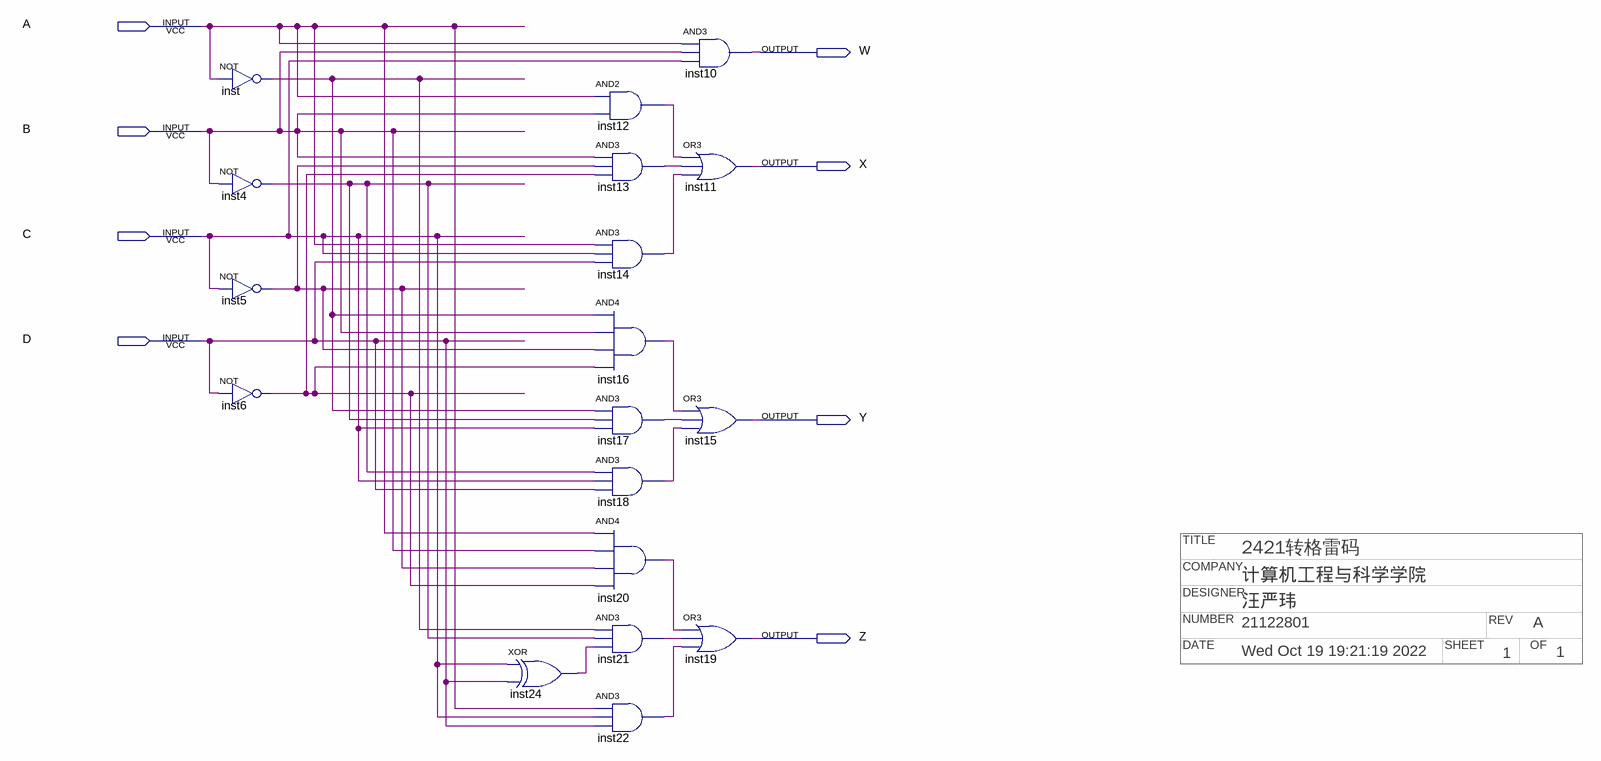
[diagram p0: schematic sheet]
// Quartus schematic 2421_to_gray.bdf as structural Verilog: 18 symbols, 8 pins
// Title block: TITLE: 2421转格雷码; COMPANY: 计算机工程与科学学院; DESIGNER: 汪严玮; NUMBER: 21122801; REV: A; DATE: Wed Oct 19 19:21:19 2022; SHEET: 1; OF: 1
module \2421_to_gray  (
  input  A,
  input  B,
  input  C,
  input  D,
  output W,
  output X,
  output Y,
  output Z
);

  wire inst4_out, inst5_out, inst6_out, inst12_out, inst13_out, inst14_out, inst16_out, inst17_out,
       inst18_out, inst20_out, inst21_out, inst22_out, inst24_out, inst_out;

  not inst (inst_out, A);
  not inst4 (inst4_out, B);
  not inst5 (inst5_out, C);
  not inst6 (inst6_out, D);
  xor inst24 (inst24_out, C, D);
  and inst12 (inst12_out, A, B);
  and inst13 (inst13_out, B, inst5_out, inst6_out);
  and inst14 (inst14_out, A, C, D);
  and inst16 (inst16_out, inst_out, B, inst5_out, inst6_out);
  and inst17 (inst17_out, inst_out, inst4_out, C);
  and inst18 (inst18_out, inst4_out, C, D);
  and inst20 (inst20_out, A, B, inst5_out, inst6_out);
  and inst21 (inst21_out, inst_out, inst4_out, inst24_out);
  and inst22 (inst22_out, A, C, D);
  and inst10 (W, A, B, C);
  or inst11 (X, inst12_out, inst13_out, inst14_out);
  or inst15 (Y, inst16_out, inst17_out, inst18_out);
  or inst19 (Z, inst20_out, inst21_out, inst22_out);
endmodule
